# Altium schematic sheet BANK18.SchDoc
size A4
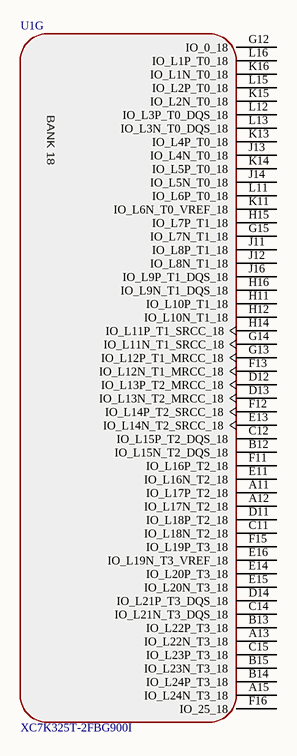
[diagram p0: BANK18.SchDoc]

## Parts
U1  XC7K325T-2FBG900I  [FBG900]  (part G of 17)

## Nets

Not connected (* = marked no-connect by the designer): U1 A11(IO_L17P_T2_18) A12(IO_L17N_T2_18) A13(IO_L22N_T3_18) A15(IO_L24N_T3_18) B12(IO_L15N_T2_DQS_18) B13(IO_L22P_T3_18) B14(IO_L24P_T3_18) B15(IO_L23N_T3_18) C11(IO_L18N_T2_18) C12(IO_L15P_T2_DQS_18) C14(IO_L21N_T3_DQS_18) C15(IO_L23P_T3_18) D11(IO_L18P_T2_18) D12(IO_L13P_T2_MRCC_18) D13(IO_L13N_T2_MRCC_18) D14(IO_L21P_T3_DQS_18) E11(IO_L16N_T2_18) E13(IO_L14N_T2_SRCC_18) E14(IO_L20P_T3_18) E15(IO_L20N_T3_18) E16(IO_L19N_T3_VREF_18) F11(IO_L16P_T2_18) F12(IO_L14P_T2_SRCC_18) F13(IO_L12N_T1_MRCC_18) F15(IO_L19P_T3_18) F16(IO_25_18) G12(IO_0_18) G13(IO_L12P_T1_MRCC_18) G14(IO_L11N_T1_SRCC_18) G15(IO_L7N_T1_18) H11(IO_L10P_T1_18) H12(IO_L10N_T1_18) H14(IO_L11P_T1_SRCC_18) H15(IO_L7P_T1_18) H16(IO_L9N_T1_DQS_18) J11(IO_L8P_T1_18) J12(IO_L8N_T1_18) J13(IO_L4N_T0_18) J14(IO_L5N_T0_18) J16(IO_L9P_T1_DQS_18) K11(IO_L6N_T0_VREF_18) K13(IO_L4P_T0_18) K14(IO_L5P_T0_18) K15(IO_L2N_T0_18) K16(IO_L1N_T0_18) L11(IO_L6P_T0_18) L12(IO_L3P_T0_DQS_18) L13(IO_L3N_T0_DQS_18) L15(IO_L2P_T0_18) L16(IO_L1P_T0_18)

## Notes on the sheet
- (in symbol XC7K325T-2FBG900I, part G) BANK 18